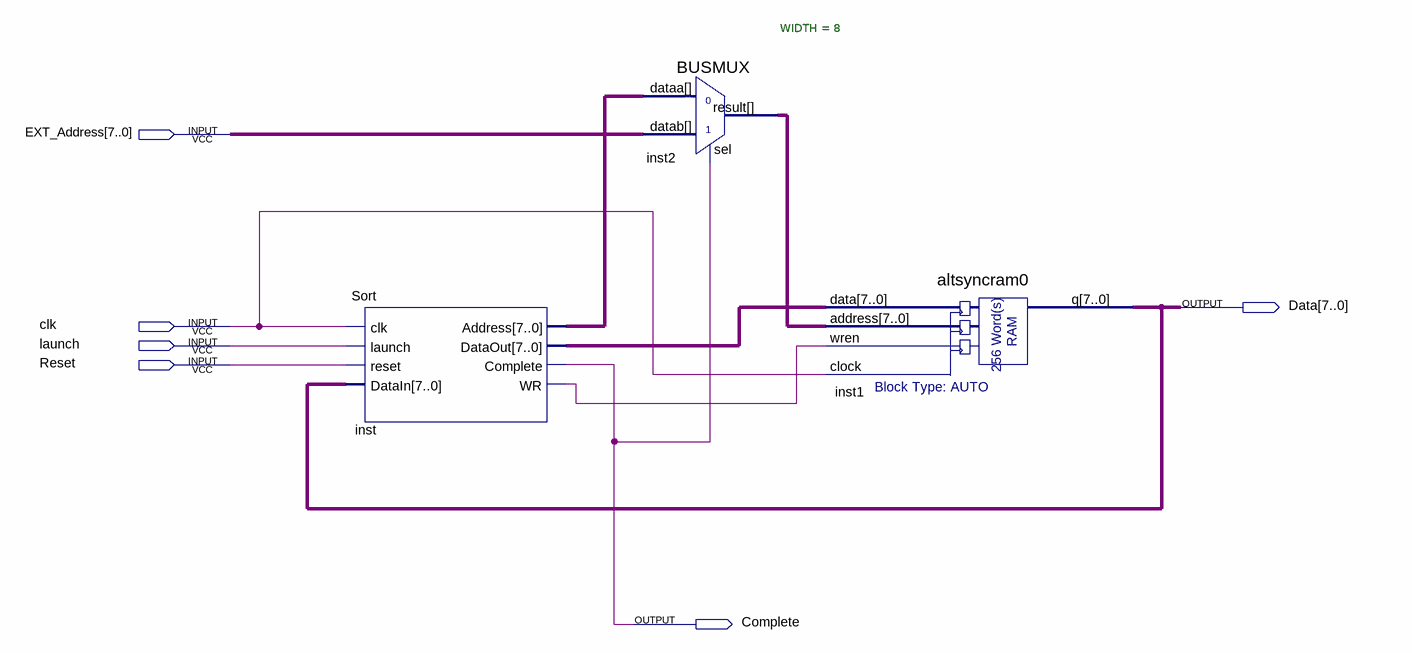
[diagram p0: schematic sheet]
// Quartus schematic BubbleSort.bdf as structural Verilog: 3 symbols, 6 pins
module BubbleSort (
  input  [7:0] EXT_Address,
  input  clk,
  input  launch,
  input  Reset,
  output [7:0] Data,
  output Complete
);

  wire inst_wr;
  wire [7:0] inst2_result, inst_address, inst_dataout;

  Sort inst (
    .clk(clk), .launch(launch), .reset(Reset), .DataIn(Data), .Address(inst_address), .DataOut(inst_dataout),
    .Complete(Complete), .WR(inst_wr));
  BUSMUX #(.WIDTH(8)) inst2 (.datab(EXT_Address), .sel(Complete), .dataa(inst_address), .result(inst2_result));
  altsyncram0 inst1 (.data(inst_dataout), .address(inst2_result), .wren(inst_wr), .clock(clk), .q(Data));
endmodule
